# EAGLE design power (EAGLE 6.6.0)

## Sheet 1 of 2: Power
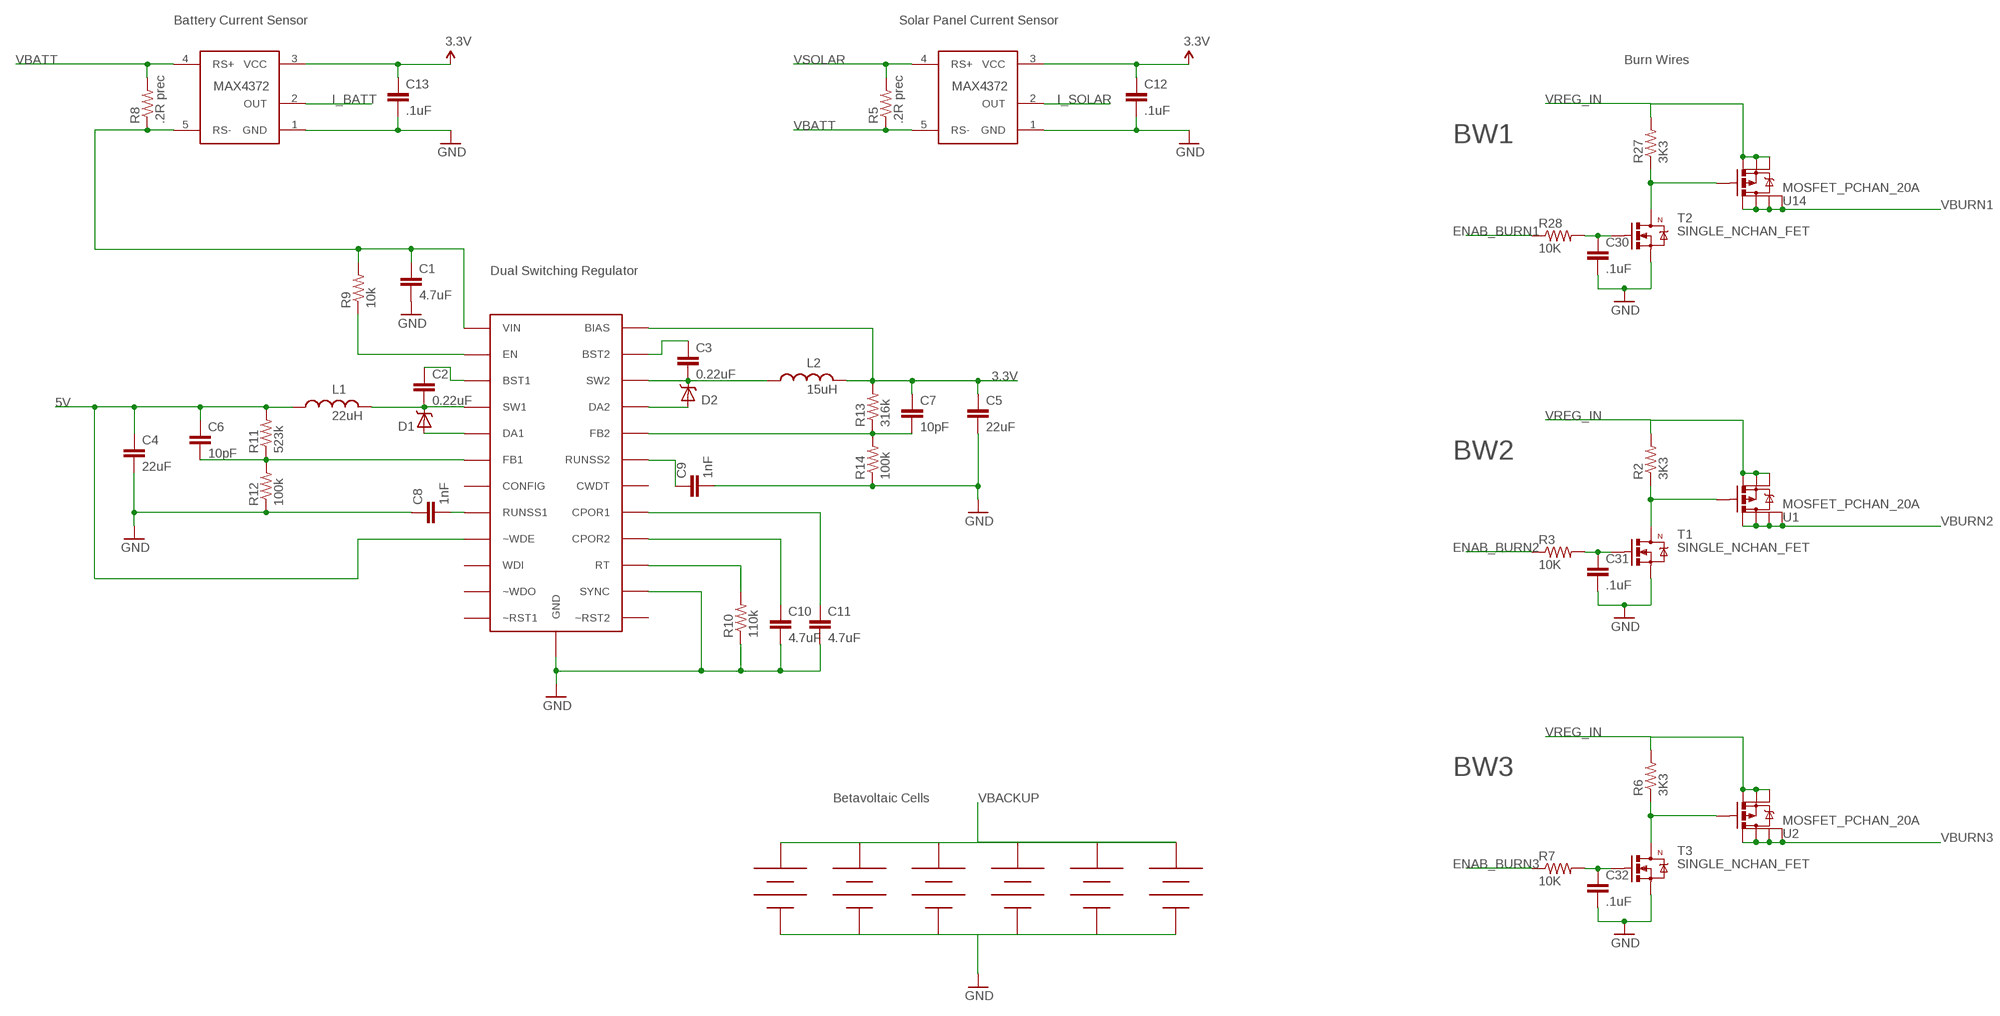
[diagram p0: schematic, sheet 1]

### Parts
C1  4.7uF  CAP0805  [0805]
C2  0.22uF  CAP0805  [0805]
C3  0.22uF  CAP0805  [0805]
C4  22uF  CAP1210  [1210]
C5  22uF  CAP1210  [1210]
C6  10pF  CAP0805  [0805]
C7  10pF  CAP0805  [0805]
C8  1nF  CAP0805  [0805]
C9  1nF  CAP0805  [0805]
C10  4.7uF  CAP0805  [0805]
C11  4.7uF  CAP0805  [0805]
C12  .1uF  CAP0805  [0805]
C13  .1uF  CAP0805  [0805]
C30  .1uF  CAP0805  [0805]
C31  .1uF  CAP0805  [0805]
C32  .1uF  CAP0805  [0805]
D1  BAT20J  DIODE-SCHOTTKY-BAT20J  [SOD-323]
D2  BAT20J  DIODE-SCHOTTKY-BAT20J  [SOD-323]
L1  SLF10145  [SLF10145]
L2  SLF10145  [SLF10145]
R2  3K3  RESISTOR0805-RES  [0805]
R3  10K  RESISTOR0805-RES  [0805]
R5  .2R prec  RESISTOR0805-RES  [0805]
R6  3K3  RESISTOR0805-RES  [0805]
R7  10K  RESISTOR0805-RES  [0805]
R8  .2R prec  RESISTOR0805-RES  [0805]
R9  10k  RESISTOR0805-RES  [0805]
R10  110k  RESISTOR0805-RES  [0805]
R11  523k  RESISTOR0805-RES  [0805]
R12  100k  RESISTOR0805-RES  [0805]
R13  316k  RESISTOR0805-RES  [0805]
R14  100k  RESISTOR0805-RES  [0805]
R27  3K3  RESISTOR0805-RES  [0805]
R28  10K  RESISTOR0805-RES  [0805]
T1  SINGLE_NCHAN_FET  [SOT23-3]
T2  SINGLE_NCHAN_FET  [SOT23-3]
T3  SINGLE_NCHAN_FET  [SOT23-3]
U1  MOSFET_PCHAN_20A  [SO8]
U2  MOSFET_PCHAN_20A  [SO8]
U14  MOSFET_PCHAN_20A  [SO8]
U$7  BETABATTERY  [BETABATTERY]
U$8  BETABATTERY  [BETABATTERY]
U$9  BETABATTERY  [BETABATTERY]
U$10  BETABATTERY  [BETABATTERY]
U$11  BETABATTERY  [BETABATTERY]
U$12  BETABATTERY  [BETABATTERY]
U$13  LT3688  [LT3688TSSOP]
U$14  CURRENT_MAX4372  [SOT23-5]
U$15  CURRENT_MAX4372  [SOT23-5]

### Nets
3.3V: C5.1 C7.1 C12.1 C13.1 L2.P2 R13.2 U$13.BIAS U$14.3(VCC) U$15.3(VCC) ; also sheet 2
5V: C4.1 C6.1 L1.P1 R11.2 U$13.WDE(~WDE) ; also sheet 2
ENAB_BURN1: R28.1
ENAB_BURN2: R3.1
ENAB_BURN3: R7.1
GND: C1.2 C4.2 C5.2 C8.1 C9.2 C10.2 C11.2 C12.2 C13.2 C30.2 C31.2 C32.2 R10.1 R12.1 R14.1 T1.2(S) T2.2(S) T3.2(S) U$7.V- U$8.V- U$9.V- U$10.V- U$11.V- U$12.V- U$13.GND U$13.SYNC U$14.1(GND) U$15.1(GND) ; also sheet 2
I_BATT: U$15.2(OUT)
I_SOLAR: U$14.2(OUT)
N$2: C31.1 R3.2 T1.1(G)
N$3: R2.1 T1.3(D) U1.4(G)
N$5: C32.1 R7.2 T3.1(G)
N$6: R6.1 T3.3(D) U2.4(G)
N$7: R9.1 U$13.EN
N$8: C9.1 U$13.RUNSS2
N$9: C2.1 U$13.BST1
N$10: C2.2 D1.C L1.P2 U$13.SW1
N$11: C3.1 U$13.BST2
N$12: C6.2 R11.1 R12.2 U$13.FB1
N$13: C8.2 U$13.RUNSS1
N$14: C7.2 R13.1 R14.2 U$13.FB2
N$15: C3.2 D2.C L2.P1 U$13.SW2
N$16: D1.A U$13.DA1
N$17: D2.A U$13.DA2
N$18: R10.2 U$13.RT
N$20: C10.1 U$13.CPOR2
N$21: C30.1 R28.2 T2.1(G)
N$22: C11.1 U$13.CPOR1
N$24: R27.1 T2.3(D) U14.4(G)
VBACKUP: U$7.V+ U$8.V+ U$9.V+ U$10.V+ U$11.V+ U$12.V+ ; also sheet 2
VBATT: R5.1 R8.2 U$14.5(RS-) U$15.4(RS+)
VBURN1: U14.5(D) U14.6(D) U14.7(D) U14.8(D) ; also sheet 2
VBURN2: U1.5(D) U1.6(D) U1.7(D) U1.8(D) ; also sheet 2
VBURN3: U2.5(D) U2.6(D) U2.7(D) U2.8(D) ; also sheet 2
VREG_IN: C1.1 R2.2 R6.2 R8.1 R9.2 R27.2 U1.1(S) U1.2(S) U1.3(S) U2.1(S) U2.2(S) U2.3(S) U14.1(S) U14.2(S) U14.3(S) U$13.VIN U$15.5(RS-) ; also sheet 2
VSOLAR: R5.2 U$14.4(RS+) ; also sheet 2
Unconnected: U$13.CONFIG U$13.CWDT U$13.RST1(~RST1) U$13.RST2(~RST2) U$13.WDI U$13.WDO(~WDO)

### Notes on the sheet
- Battery Current Sensor | Solar Panel Current Sensor
- Burn Wires
- BW1
- Dual Switching Regulator
- L2
- L1 | 15uH
- 22uH
- BW2
- BW3
- Betavoltaic Cells

## Sheet 2 of 2: Connectors
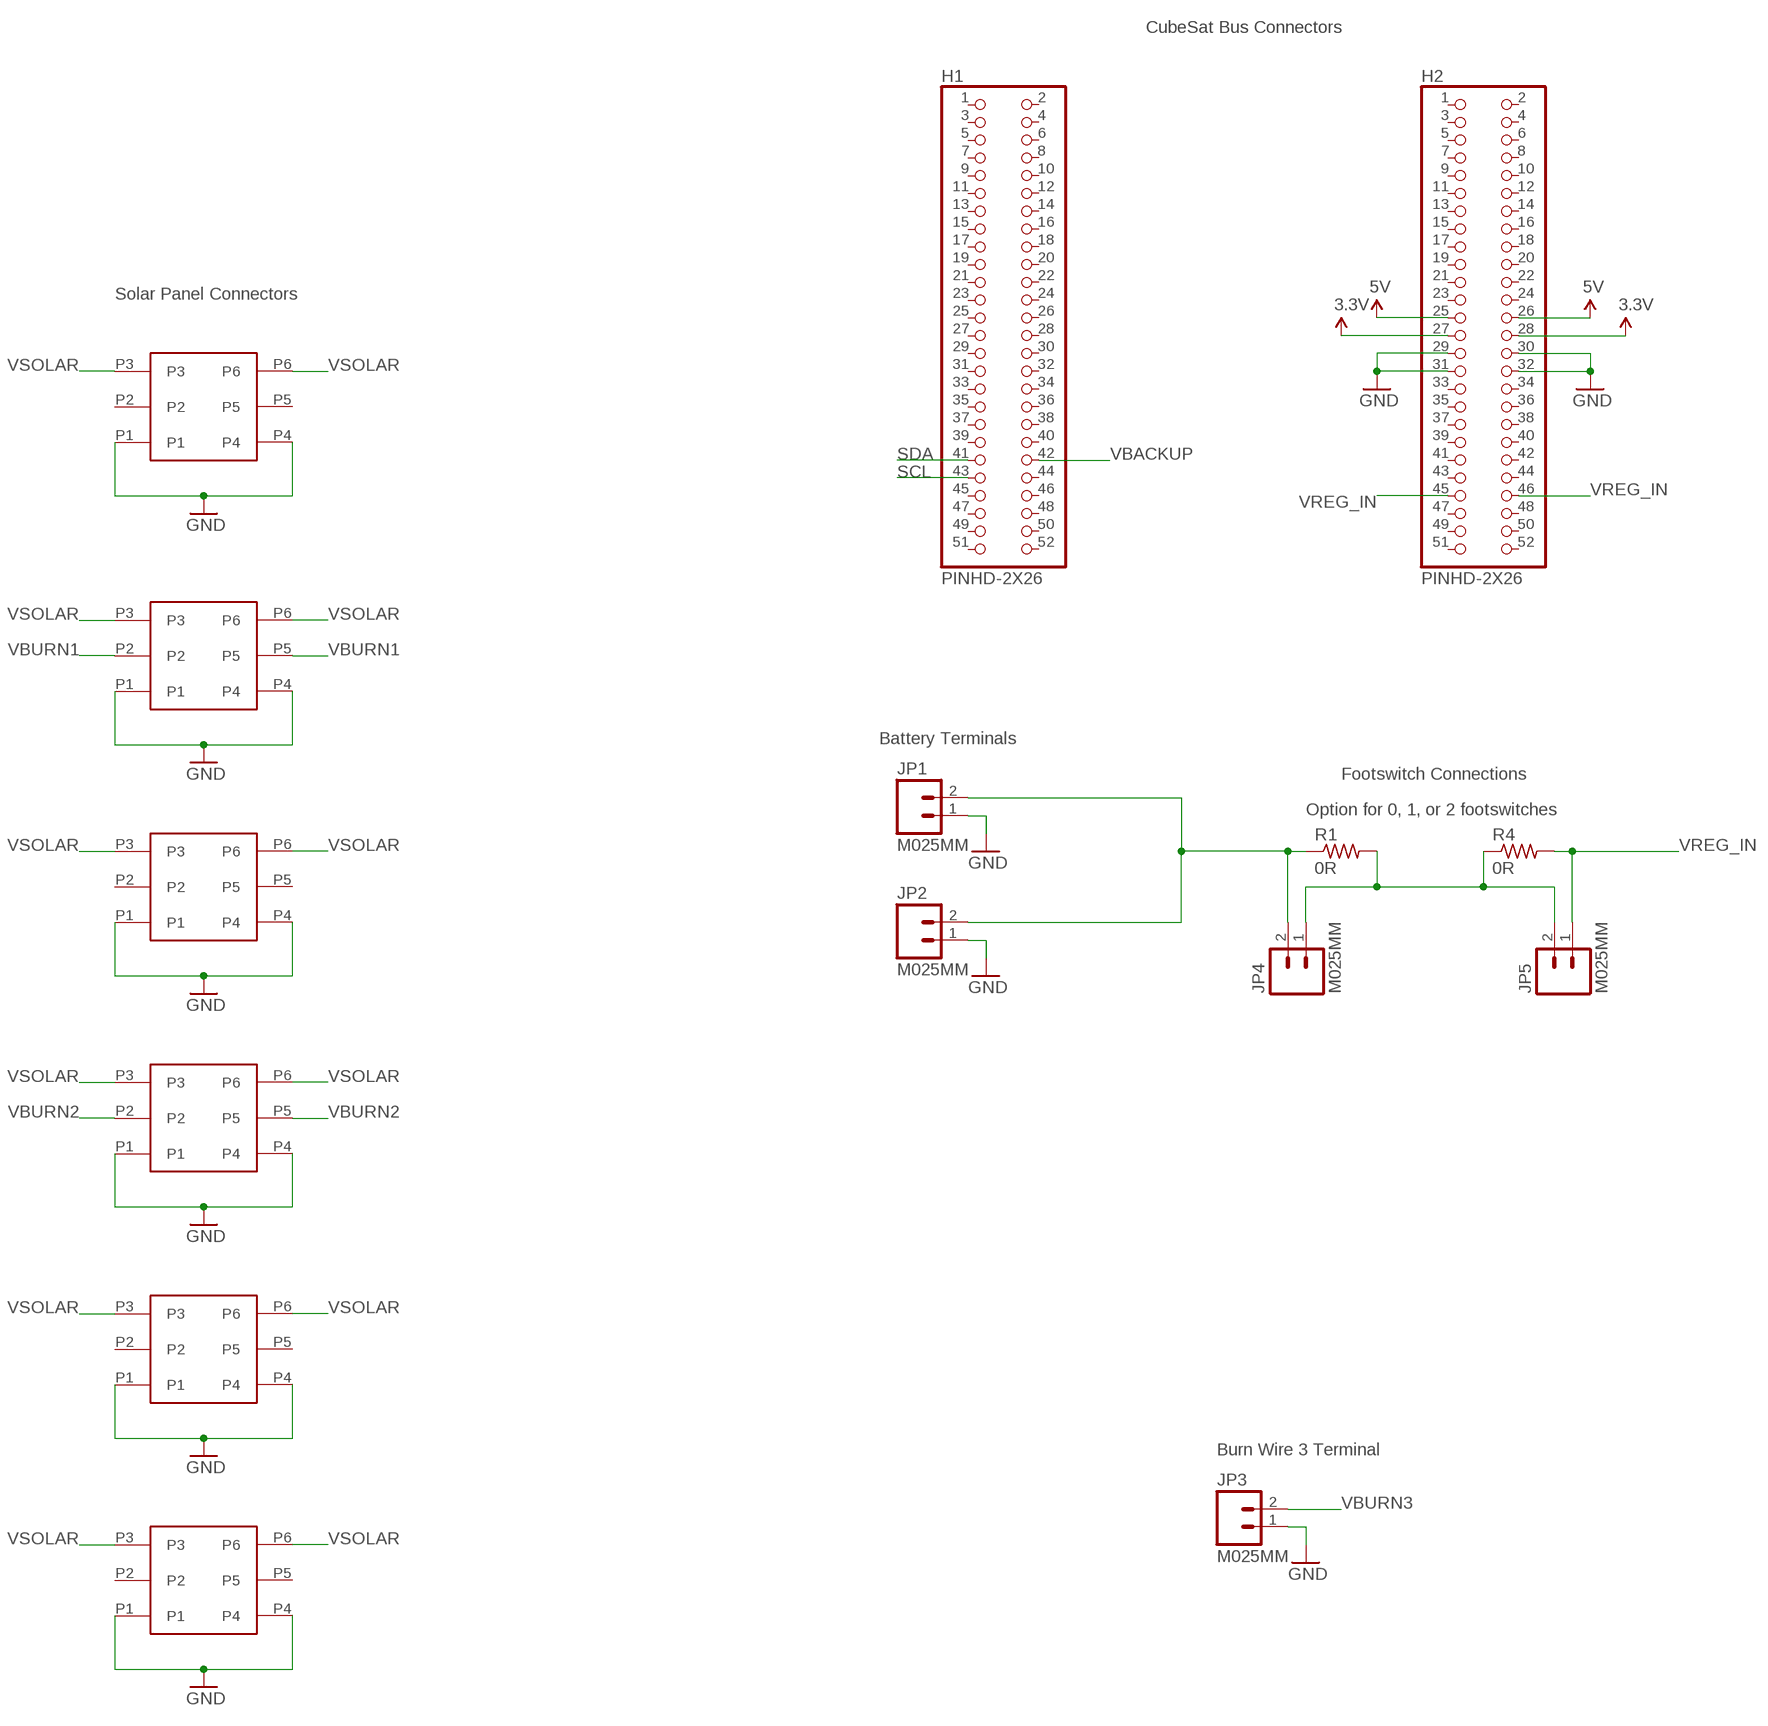
[diagram p1: schematic, sheet 2]

### Parts
H1  PINHD-2X26  [2X26]
H2  PINHD-2X26  [2X26]
JP1  M025MM  [SCREWTERMINAL-5MM-2]
JP2  M025MM  [SCREWTERMINAL-5MM-2]
JP3  M025MM  [SCREWTERMINAL-5MM-2]
JP4  M025MM  [SCREWTERMINAL-5MM-2]
JP5  M025MM  [SCREWTERMINAL-5MM-2]
R1  0R  R-US_R1210  [R1210]
R4  0R  R-US_R1210  [R1210]
U$1  G125-FV20605L0P  [G125-FV20605L0P]
U$2  G125-FV20605L0P  [G125-FV20605L0P]
U$3  G125-FV20605L0P  [G125-FV20605L0P]
U$4  G125-FV20605L0P  [G125-FV20605L0P]
U$5  G125-FV20605L0P  [G125-FV20605L0P]
U$6  G125-FV20605L0P  [G125-FV20605L0P]

### Nets
3.3V: H2.27 H2.28 ; also sheet 1
5V: H2.25 H2.26 ; also sheet 1
BATT_INPUT: JP1.2 JP2.2 JP4.2 R1.1
GND: H2.29 H2.30 H2.31 H2.32 JP1.1 JP2.1 JP3.1 U$1.P1 U$1.P4 U$2.P1 U$2.P4 U$3.P1 U$3.P4 U$4.P1 U$4.P4 U$5.P1 U$5.P4 U$6.P1 U$6.P4 ; also sheet 1
N$4: JP4.1 JP5.2 R1.2 R4.1
SCL: H1.43
SDA: H1.41
VBACKUP: H1.42 ; also sheet 1
VBURN1: U$6.P2 U$6.P5 ; also sheet 1
VBURN2: U$1.P2 U$1.P5 ; also sheet 1
VBURN3: JP3.2 ; also sheet 1
VREG_IN: H2.45 H2.46 JP5.1 R4.2 ; also sheet 1
VSOLAR: U$1.P3 U$1.P6 U$2.P3 U$2.P6 U$3.P3 U$3.P6 U$4.P3 U$4.P6 U$5.P3 U$5.P6 U$6.P3 U$6.P6 ; also sheet 1
Unconnected: H1.1 H1.2 H1.3 H1.4 H1.5 H1.6 H1.7 H1.8 H1.9 H1.10 H1.11 H1.12 H1.13 H1.14 H1.15 H1.16 H1.17 H1.18 H1.19 H1.20 H1.21 H1.22 H1.23 H1.24 H1.25 H1.26 H1.27 H1.28 H1.29 H1.30 H1.31 H1.32 H1.33 H1.34 H1.35 H1.36 H1.37 H1.38 H1.39 H1.40 H1.44 H1.45 H1.46 H1.47 H1.48 H1.49 H1.50 H1.51 H1.52 H2.1 H2.2 H2.3 H2.4 H2.5 H2.6 H2.7 H2.8 H2.9 H2.10 H2.11 H2.12 H2.13 H2.14 H2.15 H2.16 H2.17 H2.18 H2.19 H2.20 H2.21 H2.22 H2.23 H2.24 H2.33 H2.34 H2.35 H2.36 H2.37 H2.38 H2.39 H2.40 H2.41 H2.42 H2.43 H2.44 H2.47 H2.48 H2.49 H2.50 H2.51 H2.52 U$2.P2 U$2.P5 U$3.P2 U$3.P5 U$4.P2 U$4.P5 U$5.P2 U$5.P5

### Notes on the sheet
- CubeSat Bus Connectors
- Solar Panel Connectors
- Battery Terminals
- Footswitch Connections
- Option for 0, 1, or 2 footswitches
- Burn Wire 3 Terminal

## Library data of the parts
C1-C13 C30-C32 = SparkFun-Capacitors:CAP: Capacitor Standard 0603 ceramic capacitor, and 0.1" leaded capacitor.
D1 D2 = SparkFun-DiscreteSemi:DIODE-SCHOTTKY: Schottky diodes in SFE's production catalog BAT20J 1A 23V 0.62Vf RB751 120mA 40V 0.37Vf PMEG4005EJ 0.5A 40V 0.42Vf MBRA140 1A 40V 0.5Vf B340A 3A 40V SMA; PROD_ID: DIO-11623
H1 H2 = SparkFun-Connectors:PINHD-2X26
JP1-JP5 = SparkFun-Connectors:M02: Standard 2-pin 0.1" header. Use with - straight break away headers ( PRT-00116) - right angle break away headers (PRT-00553) - swiss pins (PRT-00743) - machine pins (PRT-00117) - female headers (PRT-00115) Molex polarized connector foot print use with: PRT-08233 with associated crimp pins and housings. 2.54_SCREWTERM for use with PRT-10571. 3.5mm Screw Terminal footprints for PRT-08084 5mm Screw Terminal footprints for use with PRT-08433
L1 L2 = SLF10145:SLF10145
R1 R4 = rcl:R-US_: RESISTOR, American symbol
R2 R3 R5-R14 R27 R28 = SparkFun-Resistors:RESISTOR: Resistor Basic schematic elements and footprints for 0603, 1206, and PTH resistors.
T1-T3 = phonesat:SINGLE_NCHAN_FET
U1 U2 U14 = phonesat:MOSFET_PCHAN_20A
U$1-U$6 = G125-FV20605L0P:G125-FV20605L0P: Harwin Gecko female connector, 2x3
U$7-U$12 = Widetronix:BETABATTERY
U$13 = LT3688:LT3688
U$14 U$15 = phonesat:CURRENT_MAX4372

## Board
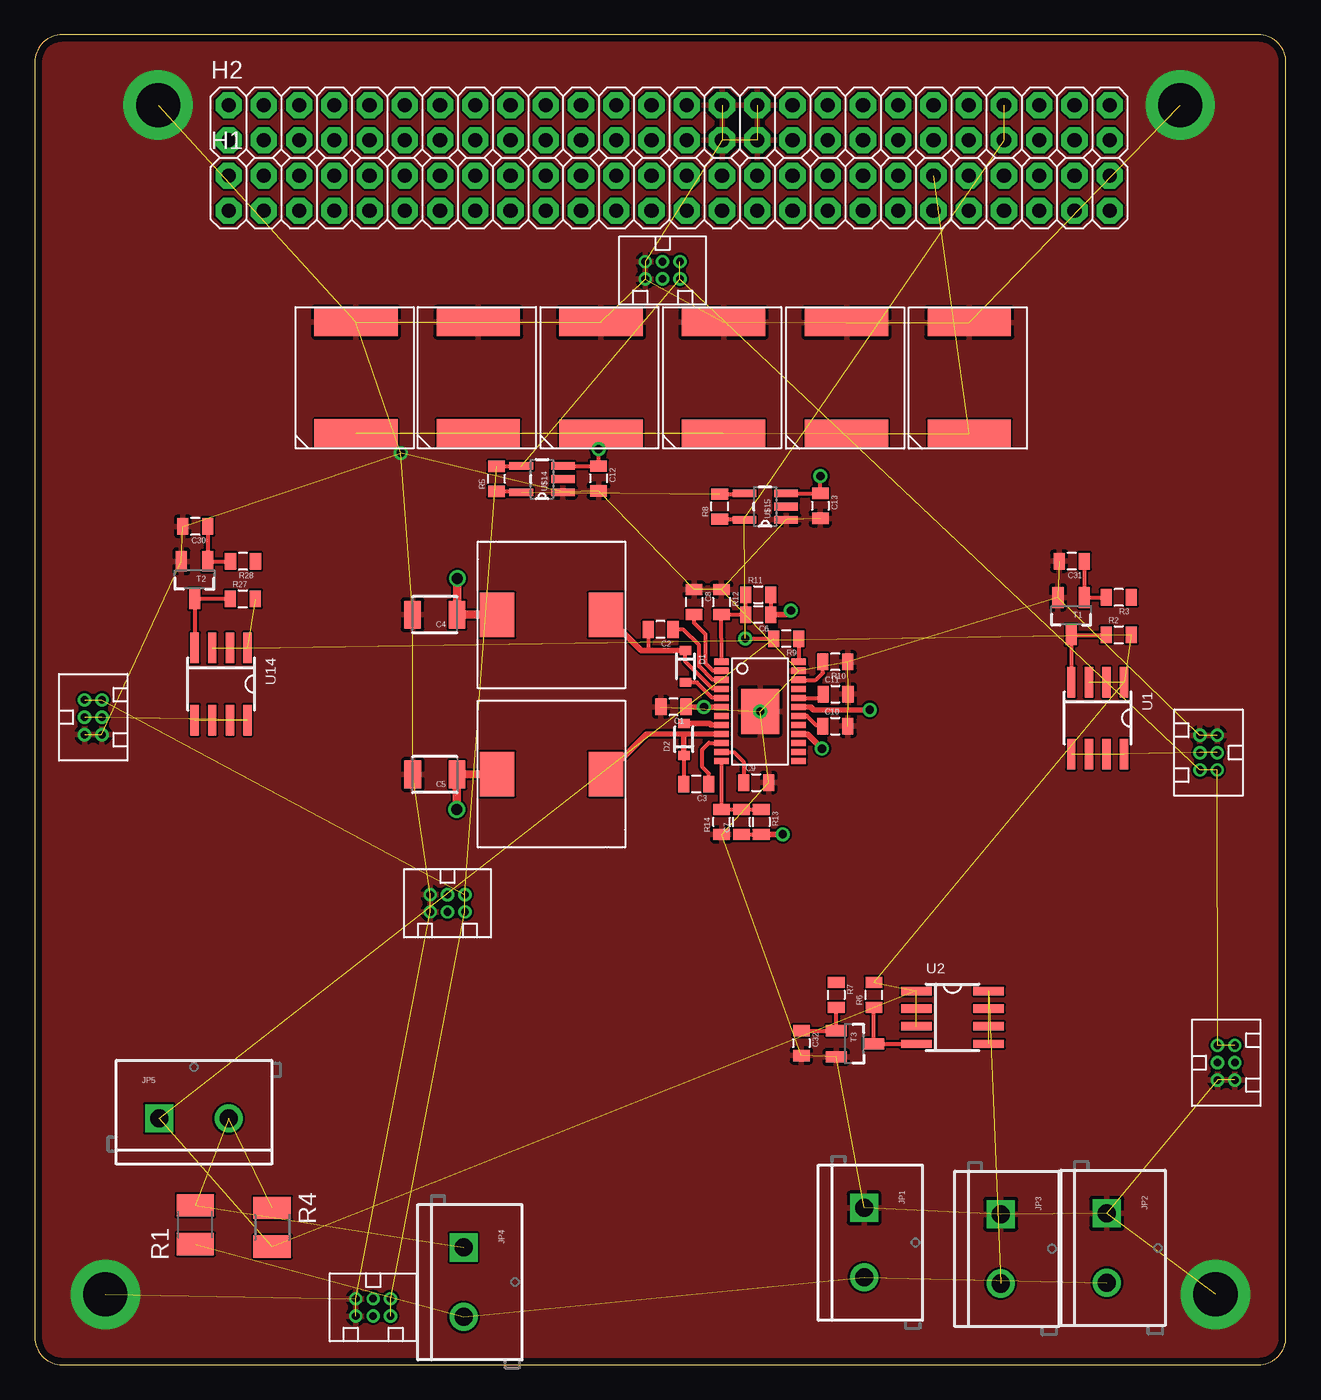
[diagram p2: board, top side]
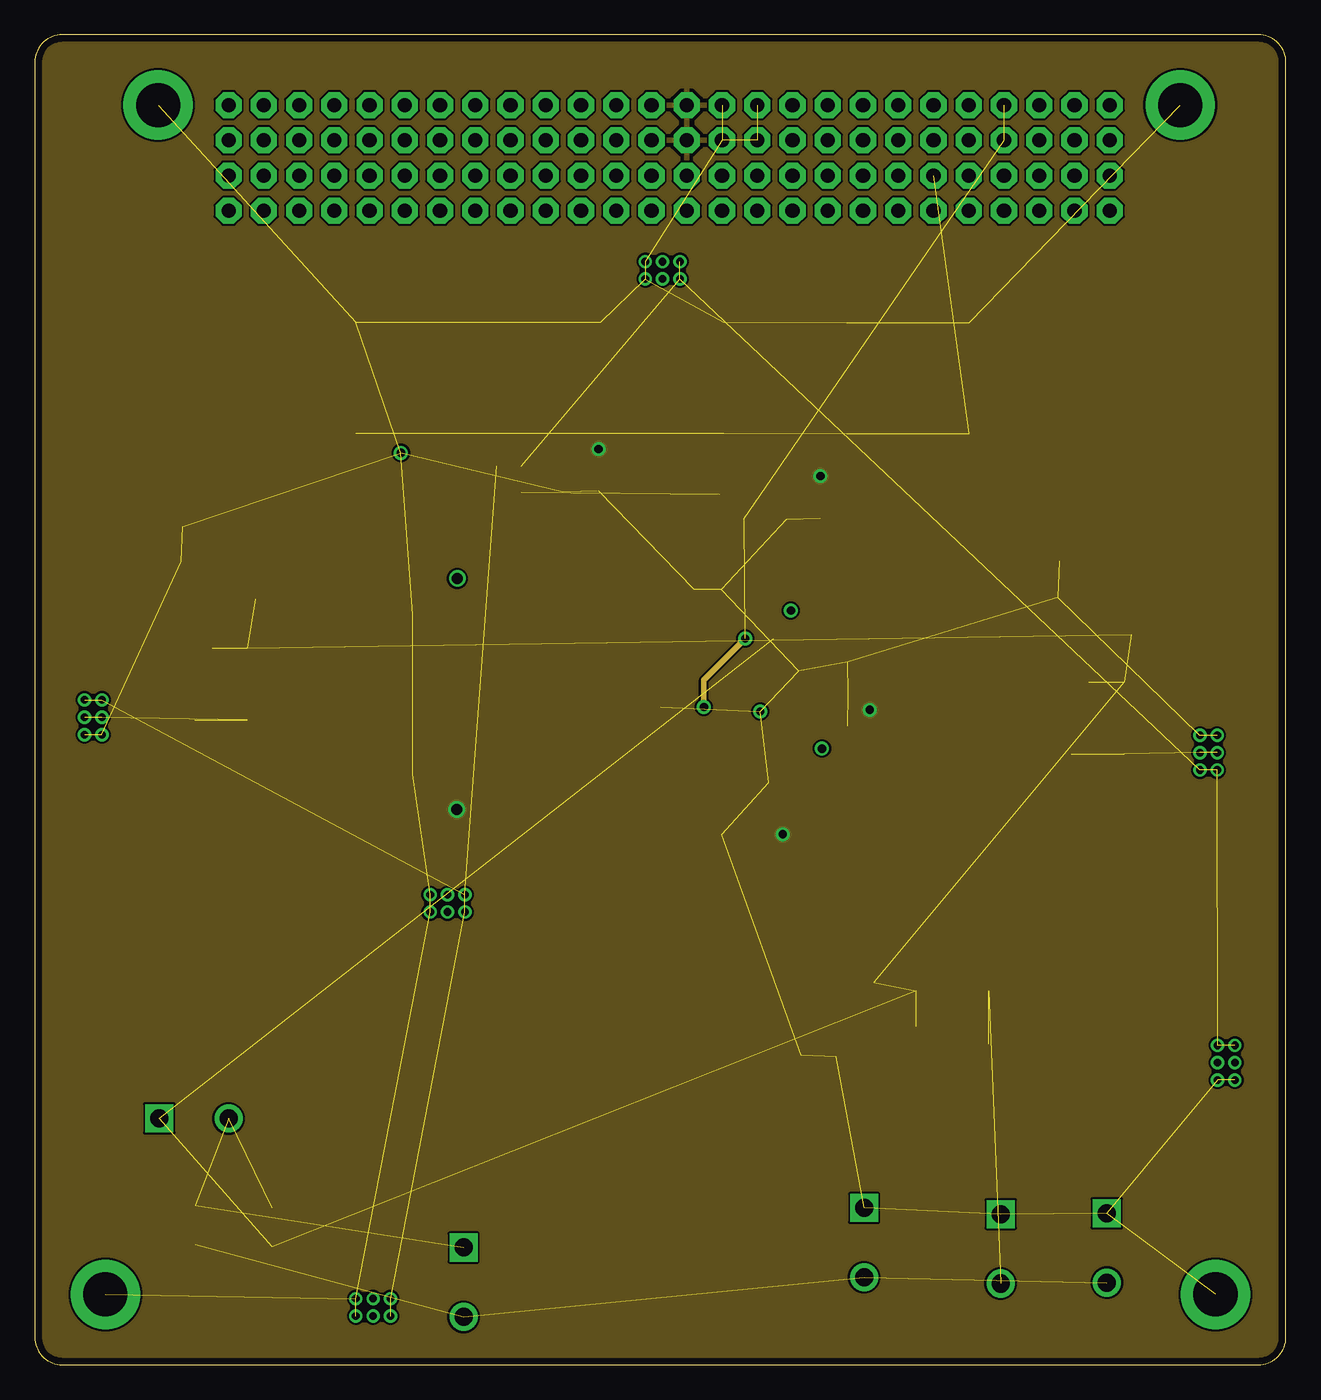
[diagram p3: board, inner layer Route2]
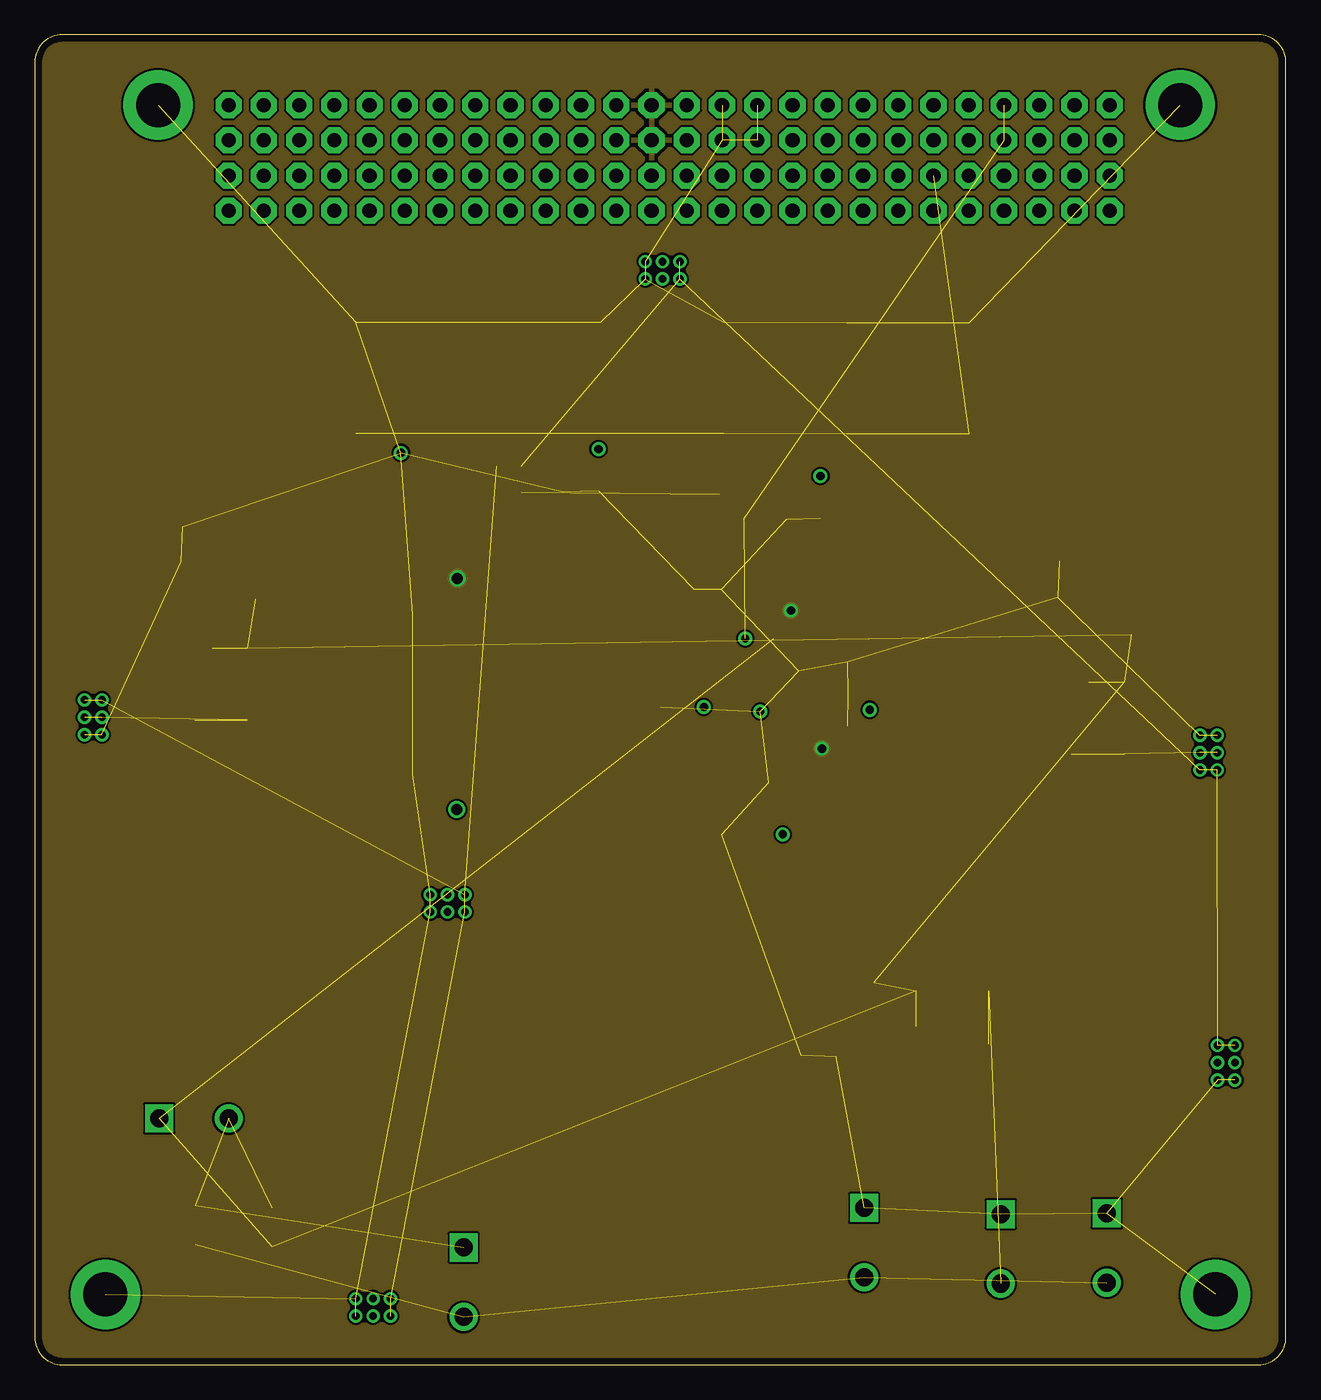
[diagram p4: board, inner layer Route15]
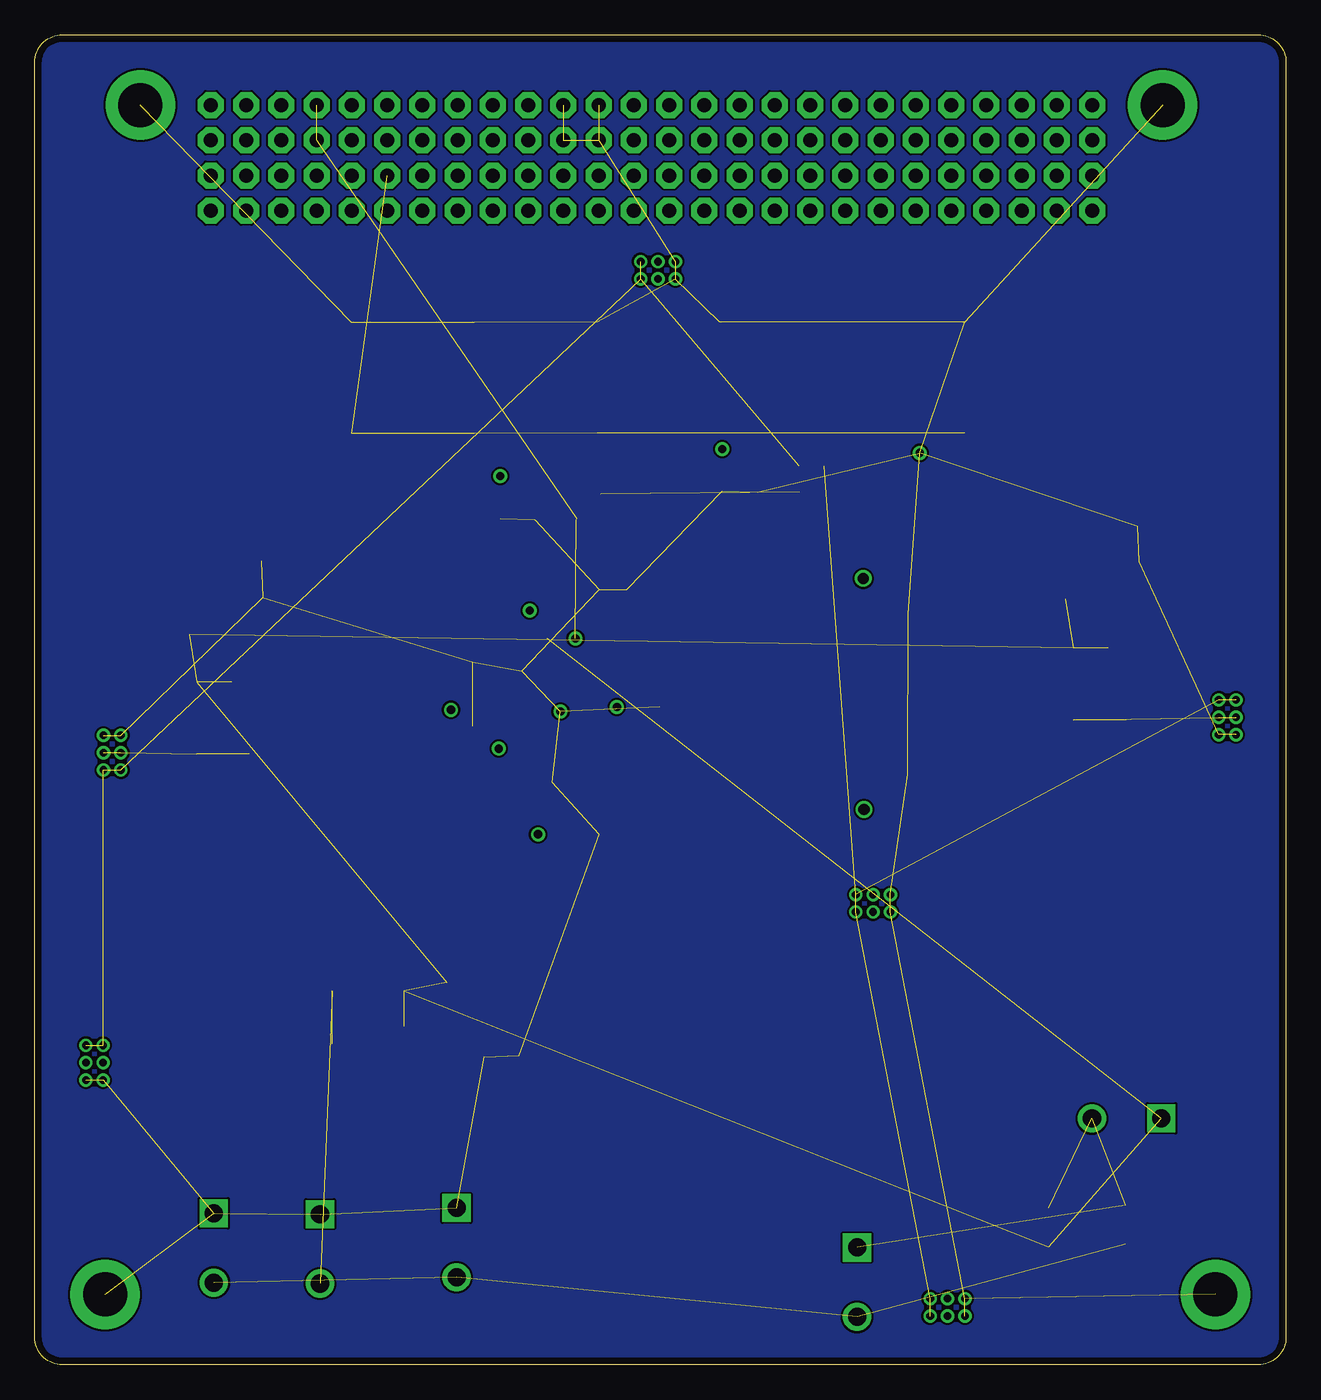
[diagram p5: board, bottom side, seen from below]

Size 90.17 x 95.89 mm. Coordinates in mm from the lower left corner, seen from the top.
Outline: 0,93.89 0,2 arc90 2,0 88.17,0 arc90 90.17,2 90.17,93.89 arc90 88.17,95.89 2,95.89 arc90 0,93.89
Copper layers (1+2*15+16): Top 0.0178mm / dielectric 12mil / Route2 0.0356mm / dielectric 28mil / Route15 0.0356mm / dielectric 12mil / Bottom 0.0178mm
Design rules "SSC-EAGLE-4Lyr_v1.0.0.3": minimum track width 6mil, minimum drill 8mil, track to track 6mil, track to pad 6mil, pad to pad 6mil, via to via 6mil, smd to smd 6mil, copper to edge 20mil, drill to drill 16mil, minimum pad ring 8mil, minimum via ring 8mil, stop-mask expansion 3mil, vias tented up to drill 0mil, thermal gap 10mil

### Footprints (pad centres in the part's own frame; a part is rotated, then mirrored left to right if it is on the bottom)
0805 = smd 0.8 x 1.2: 1 -0.9,0; 2 0.9,0
1210 = smd 1.2 x 2: 1 -1.6,0; 2 1.6,0
SOD-323 = smd 0.63 x 0.83: A 1.15,0; C -1.15,0
2X26 = drill 1.016 pad 1.88 octagon: 1 -11.43,-1.27; 2 -11.43,1.27; 3 -8.89,-1.27; 4 -8.89,1.27; 5 -6.35,-1.27; 6 -6.35,1.27; 7 -3.81,-1.27; 8 -3.81,1.27; 9 -1.27,-1.27; 10 -1.27,1.27; 11 1.27,-1.27; 12 1.27,1.27; 13 3.81,-1.27; 14 3.81,1.27; 15 6.35,-1.27; 16 6.35,1.27; 17 8.89,-1.27; 18 8.89,1.27; 19 11.43,-1.27; 20 11.43,1.27; 21 13.97,-1.27; 22 13.97,1.27; 23 16.51,-1.27; 24 16.51,1.27; 25 19.05,-1.27; 26 19.05,1.27; 27 21.59,-1.27; 28 21.59,1.27; 29 24.13,-1.27; 30 24.13,1.27; 31 26.67,-1.27; 32 26.67,1.27; 33 29.21,-1.27; 34 29.21,1.27; 35 31.75,-1.27; 36 31.75,1.27; 37 34.29,-1.27; 38 34.29,1.27; 39 36.83,-1.27; 40 36.83,1.27; 41 39.37,-1.27; 42 39.37,1.27; 43 41.91,-1.27; 44 41.91,1.27; 45 44.45,-1.27; 46 44.45,1.27; 47 46.99,-1.27; 48 46.99,1.27; 49 49.53,-1.27; 50 49.53,1.27; 51 52.07,-1.27; 52 52.07,1.27
SCREWTERMINAL-5MM-2 = drill 1.3 pad 2.032 square: 1 0,0 | drill 1.3 pad 2.032: 2 5,0
SLF10145 = smd 2.5 x 3.2: P1 -3.925,0; P2 3.925,0
R1210 = smd 1.6 x 2.7: 1 -1.4,0; 2 1.4,0
SOT23-3 = smd 0.8 x 1.5: 1 -0.95,-1.3; 2 0.95,-1.3; 3 0,1.4
SO8 = smd 0.6 x 2.2: 1 -1.905,-2.6; 2 -0.635,-2.6; 3 0.635,-2.6; 4 1.905,-2.6; 5 1.905,2.6; 6 0.635,2.6; 7 -0.635,2.6; 8 -1.905,2.6
G125-FV20605L0P = drill 0.55: P1 1.87,3.085; P2 3.12,3.085; P3 4.37,3.085; P4 1.87,1.835; P5 3.12,1.835; P6 4.37,1.835
BETABATTERY = smd 2 x 6: V+ -4,-0.1; V- 4,-0.1
LT3688TSSOP = smd 1.05 x 0.45: BIAS 2.775,0.325; BST1 -2.775,2.275; BST2 -2.775,-2.275; CONFIG -2.775,-0.325; CPOR1 2.775,0.975; CPOR2 2.775,-0.325; CWDT 2.775,1.625; DA1 -2.775,0.975; DA2 -2.775,-0.975; EN 2.775,3.575; FB1 -2.775,3.575; FB2 -2.775,-3.575; RST1 2.775,-2.925; RST2 2.775,-3.575; RT 2.775,2.275; RUNSS1 -2.775,2.925; RUNSS2 -2.775,-2.925; SW1 -2.775,1.625; SW2 -2.775,-1.625; SYNC 2.775,2.925; VIN -2.775,0.325; WDE 2.775,-1.625; WDI 2.775,-0.975; WDO 2.775,-2.275 | smd 2.74 x 3.25: GND 0,0
SOT23-5 = smd 0.55 x 1.7: 1 -0.95,-1.5; 2 0,-1.5; 3 0.95,-1.5; 4 0.95,1.5; 5 -0.95,1.5

### Placement (x,y rotation side)
C1  46.03,47.43 180 top
C2  45.1,53 180 top
C3  47.68,41.86 180 top
C4  28.83,54.07 180 top
C5  28.84,42.55 180 top
C6  52.15,54.08 180 top
C7  50.93,39.14 90 top
C8  47.52,54.98 270 top
C9  51.99,41.97 0 top
C10  57.7,46.04 0 top
C11  57.71,48.35 0 top
C12  40.63,63.9 270 top
C13  56.62,61.92 270 top
C30  11.58,60.44 180 top
C31  74.73,57.93 180 top
C32  55.25,23.19 270 top
D1  46.89,50.35 270 top
D2  46.78,45.08 90 top
H1  25.4,84.46 0 top
H2  25.4,89.54 0 top
JP1  59.77,11.31 270 top
JP2  77.26,10.92 270 top
JP3  69.61,10.86 270 top
JP4  30.91,8.46 270 top
JP5  8.98,17.76 0 top
L1  37.24,54.06 0 top
L2  37.24,42.58 180 top
R1  11.57,10.1 90 top
R2  78.12,52.63 0 top
R3  78.12,55.32 180 top
R4  17.11,9.92 270 top
R5  33.28,63.87 90 top
R6  60.47,26.67 90 top
R7  57.76,26.67 270 top
R8  49.37,61.88 90 top
R9  54.15,52.35 180 top
R10  57.7,50.67 180 top
R11  52.15,55.52 0 top
R12  49.49,54.98 270 top
R13  52.36,39.14 270 top
R14  49.5,39.14 90 top
R27  15,55.22 0 top
R28  15.01,57.92 180 top
T1  74.69,54.02 180 top
T2  11.52,56.62 180 top
T3  59.06,23.14 270 top
U1  76.6,46.62 180 top
U2  66.14,25.04 270 top
U14  13.43,49.08 180 top
U$1  82.13,47.25 270 top
U$2  21.27,1.68 0 top
U$3  42.13,76.44 0 top
U$4  88.32,18.66 90 top
U$5  26.63,30.81 0 top
U$6  6.68,43.56 90 top
U$7  23.05,71.16 90 top
U$8  31.87,71.16 90 top
U$9  40.7,71.15 90 top
U$10  49.54,71.15 90 top
U$11  58.4,71.14 90 top
U$12  67.24,71.14 90 top
U$13  52.28,47.1 0 top
U$14  36.56,63.85 90 top
U$15  52.64,61.87 90 top

### Tracks (layer width: path | path; a pad name or v marks a point on that pad's centre or on a via)
3.3V  (via drill 0.6, 0.8)
  Top 0.305: C7.1 R13.2 | U$14.3 C12.1 v40.63,66.01 | U$15.3 C13.1 v56.62,64.07
  Top 0.406: C5.1 30.41,42.55 | R13.2 v53.9,38.24 | U$13.BIAS 55.91,47.42 56.13,47.21 v60.16,47.21 v60.17,47.22
  Top 0.61: C5.1 L2.P2 | 30.41,42.55 v30.41,40.03
  Route2 0.305: v56.62,64.07 56.62,64.1 | v40.63,66.01 v40.63,66.02
  Route2 0.406: v30.41,40.03 30.41,39.93 | v53.9,38.24 53.96,38.24 | v60.17,47.22 v60.16,47.22 60.15,47.23
  pour Route2: 88.17,0 2,0 arc-90 0,2 0,93.89 arc-90 2,95.89 88.17,95.89 arc-90 90.17,93.89 90.17,2 arc-90
5V  (via drill 0.6, 0.8)
  Top 0.305: R11.2 C6.1
  Top 0.406: 33.3,54.07 L1.P1 | C4.1 30.46,54.07 | C6.1 54.2,54.08 v54.49,54.37 | U$13.WDE 55.67,45.48 v56.73,44.42
  Top 0.61: v30.46,56.69 30.46,54.07 L1.P1
  Route15 0.406: v30.46,56.69 30.46,56.78 | v54.49,54.37 54.55,54.43 | v56.73,44.42 v56.72,44.42
  pour Route15: 0,2 0,93.89 arc-90 2,95.89 88.17,95.89 arc-90 90.17,93.89 90.17,2 arc-90 88.17,0 2,0 arc-90
BATT_INPUT  (3 unrouted)
GND  (via drill 0.6, 3.17 pad 5)  (51 unrouted)
  other vias: 8.89,90.81 82.55,90.81 85.09,5.08 5.09,5.08 26.39,65.74 52.28,47.1
  pour Top: 88.17,0 2,0 arc-90 0,2 0,93.89 arc-90 2,95.89 88.17,95.89 arc-90 90.17,93.89 90.17,2 arc-90
N$1
  pour Bottom: 2,95.89 88.17,95.89 arc-90 90.17,93.89 90.17,2 arc-90 88.17,0 2,0 arc-90 0,2 0,93.89 arc-90
N$2
  Top 0.305: C31.1 T1.1 R3.2
N$3
  Top 0.305: U1.4 T1.3 77.19,52.62 R2.1
N$4  (3 unrouted)
N$5
  Top 0.305: R7.2 T3.1 C32.1
N$6
  Top 0.305: U2.4 T3.3 R6.1
N$7
  Top 0.305: R9.1 U$13.EN
N$8
  Top 0.305: U$13.RUNSS2 50.38,44.17 51.09,43.46 C9.1
N$9
  Top 0.305: U$13.BST1 48.88,49.38 47.88,50.37 47.88,51.87 46.75,53 C2.1
N$10
  Top 0.305: U$13.SW1 48.87,48.73 46.89,50.7 D1.C | C2.2 44.2,51.58 44.28,51.5
  Top 0.406: D1.C 44.28,51.5 43.73,51.5 L1.P2
N$11
  Top 0.305: C3.1 48.58,42.62 48.11,43.09 48.11,44.35 48.59,44.83 U$13.BST2
N$12
  Top 0.305: U$13.FB1 R12.2 C6.2 R11.1
N$13
  Top 0.305: U$13.RUNSS1 48.88,50.02 48.34,50.57 48.34,52.66 47.52,53.48 C8.2
N$14
  Top 0.305: R13.1 C7.2 R14.2 U$13.FB2
N$15
  Top 0.305: U$13.SW2 | D2.C C3.2
  Top 0.406: U$13.SW2 46.83,45.48 | D2.C 46.78,45.42 46.83,45.48 | 46.83,45.48 44.12,45.48 41.23,42.59 L2.P1
N$16
  Top 0.305: U$13.DA1 48.84,48.08 47.71,49.2 D1.A
N$17
  Top 0.406: U$13.DA2 48.76,46.12 48.65,46.23 D2.A
N$18
  Top 0.305: U$13.RT 56.3,49.38 56.8,49.88 R10.2
N$20
  Top 0.305: U$13.CPOR2 55.65,46.77 56.3,46.12 56.72,46.12 C10.1
N$21
  Top 0.305: R28.2 T2.1 C30.1
N$22
  Top 0.305: U$13.CPOR1 56.53,48.08 C11.1
N$24
  Top 0.305: U14.4 T2.3 R27.1
VBACKUP  (6 unrouted)
VBATT  (1 unrouted)
  Top 0.305: R8.2 51.1,62.78 U$15.4 | R5.1 34.99,62.97 U$14.5
VBURN1  (5 unrouted)
VBURN2  (5 unrouted)
VBURN3  (4 unrouted)
VREG_IN  (via drill 0.6)  (17 unrouted)
  Top 0.305: C1.1 | v48.22,47.42 v48.22,47.43 | v51.2,52.35 R9.2 | R8.1 51.08,60.98 U$15.5
  Top 0.406: U$13.VIN v48.22,47.42 | C1.1 v48.22,47.43
  Route2 0.406: v48.22,47.42 48.22,49.37 v51.2,52.35
VSOLAR  (12 unrouted)
  Top 0.305: R5.2 35.03,64.77 U$14.4